# Altium project KNX_MCU_8CH_V1.2.PrjPcb
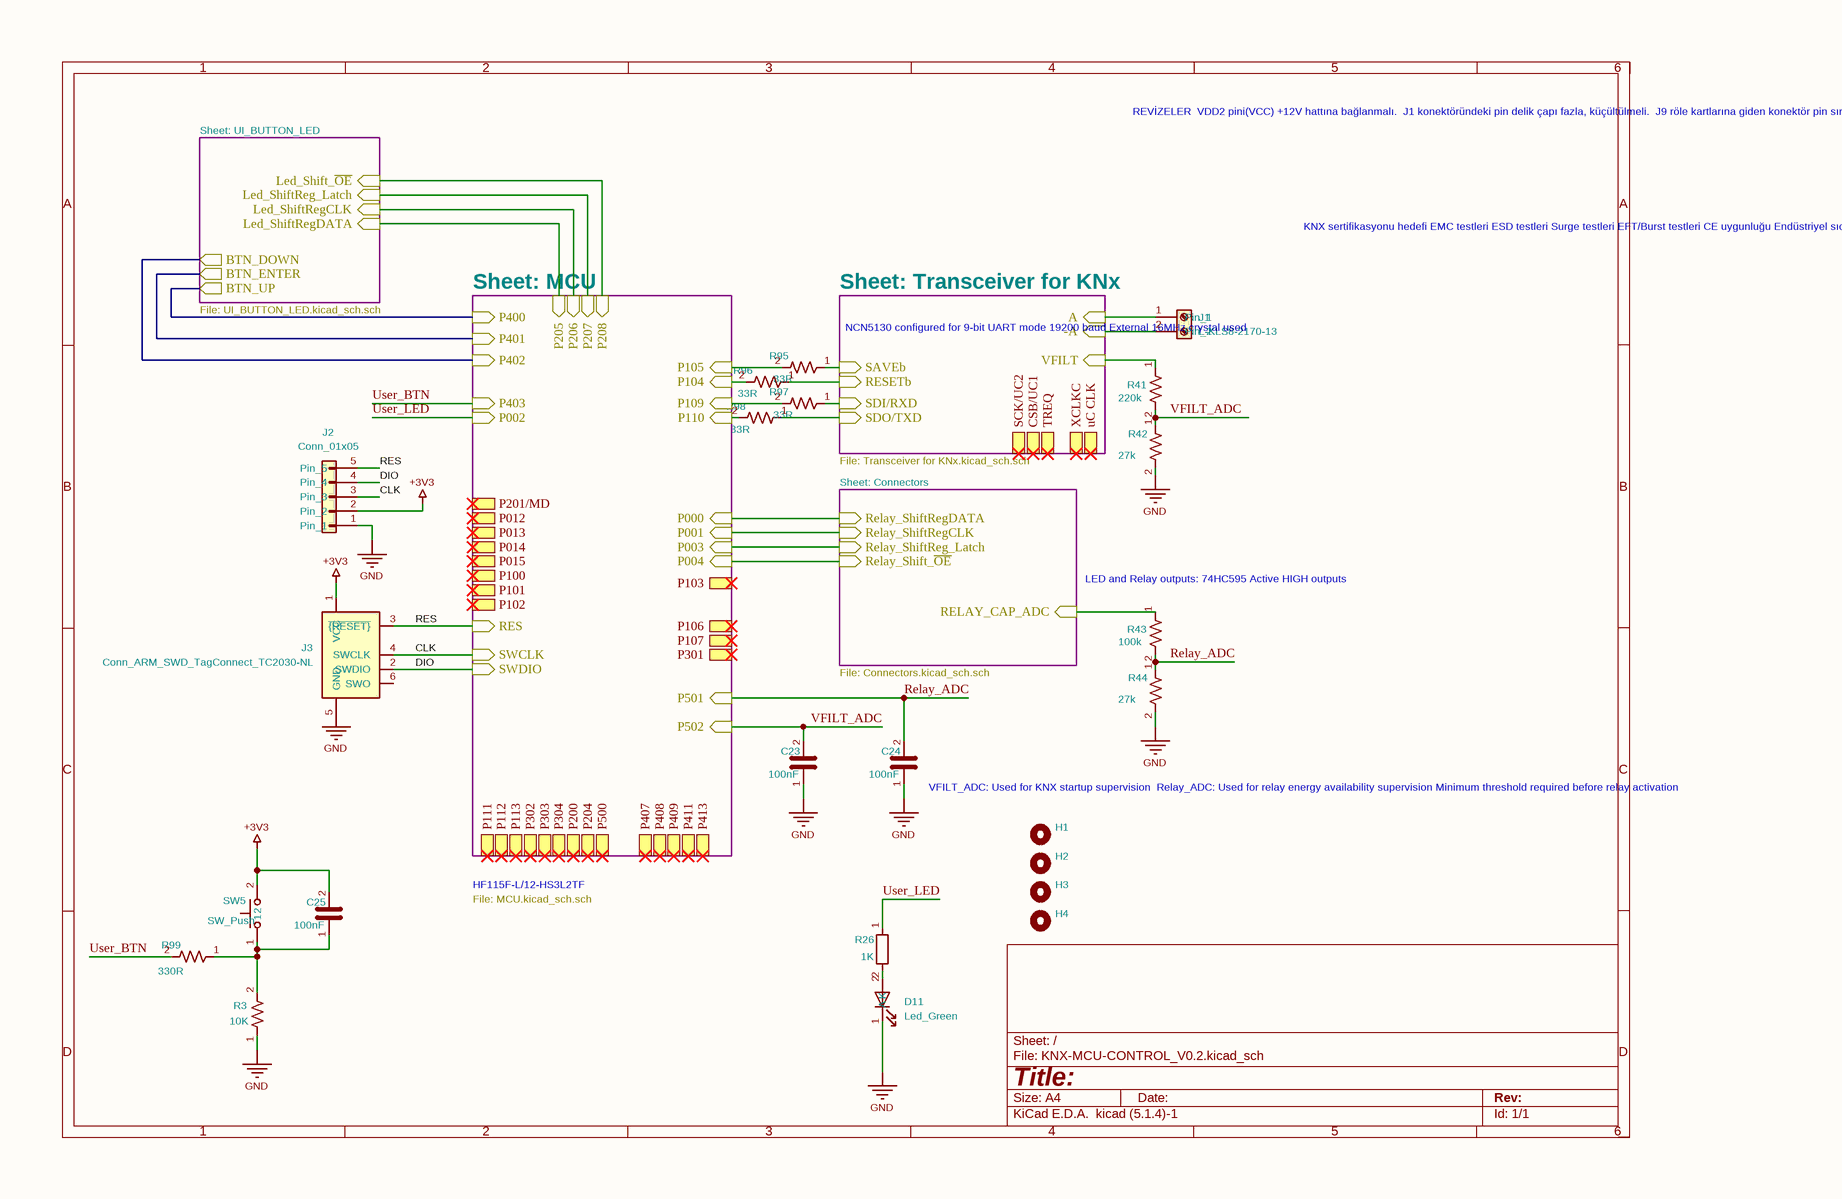
[diagram p0: KNX-MCU-CONTROL_V0.2.SchDoc]
4 sheets, 85 parts. Net scope: hierarchical (ports join the sheet entries above them; power ports are global).
Board file: KNX_MCU_8CH_V1.2.PcbDoc
Sheets:
  KNX-MCU-CONTROL_V0.2.SchDoc
    Transceiver for KNx = Transceiver for KNx.SchDoc
    Connectors = Connectors.SchDoc
    UI_BUTTON_LED = UI_BUTTON_LED.SchDoc

## Sheet KNX-MCU-CONTROL_V0.2.SchDoc
size 297 x 209 mm

### Parts
C23  100nF  [C_0603_1608Metric]
C24  100nF  [C_0603_1608Metric]
C25  100nF  [C_0603_1608Metric]
D11  Led_Green  [LED_D3.0mm]
H1  YP-1132-20-0-N-0  [MountingHole_3mm]  (value not drawn)
H2  YP-1132-20-0-N-0  [MountingHole_3mm]  (value not drawn)
H3  YP-1132-20-0-N-0  [MountingHole_3mm]  (value not drawn)
H4  YP-1132-20-0-N-0  [MountingHole_3mm]  (value not drawn)
J1  L-KLS8-2170-13  [Samtec_HPM-02-01-x-S_Straight_1x02_Pitch5.08mm]
J2  Conn_01x05  [PinHeader_1x05_P2.54mm_Vertical]  (no BOM)
J3  Conn_ARM_SWD_TagConnect_TC2030-NL  [Tag-Connect_TC2030-IDC-NL_2x03_P1.27mm_Vertical]  (no BOM)
R3  10K  [R_0603_1608Metric]
R26  1K  [R_0603_1608Metric]
R41  220k  [R_0603_1608Metric]
R42  27k  [R_0603_1608Metric]
R43  100k  [R_0603_1608Metric]
R44  27k  [R_0603_1608Metric]
R95  33R  [R_0603_1608Metric]
R96  33R  [R_0603_1608Metric]
R97  33R  [R_0603_1608Metric]
R98  33R  [R_0603_1608Metric]
R99  330R  [R_0603_1608Metric]
SW5  SW_Push  [SW_SPST_Omron_B3FS-100xP]

### Sub-sheets
Connectors = Connectors.SchDoc: RELAY_CAP_ADC (in), Relay_ShiftRegCLK (in), Relay_ShiftRegDATA (in), Relay_Shift_~{OE} (in), Relay_ShiftReg_Latch (in)
MCU = MCU.SchDoc (file not in this document): P000 (in), P001 (in), P003 (in), P104 (in), P105 (in), P109 (in), P110 (in), P400 (in), P401 (in), P402 (in), P501 (in), RES (in), SWCLK (in), SWDIO (in), P004 (in), P205 (in), P206 (in), P207 (in), P208 (in), P403 (in), P002 (in), P502 (in), P012, P013, P014, P015, P100, P101, P102, P103, P106, P107, P301, P111, P112, P113, P302, P303, P304, P200, P204, P500, P407, P408, P409, P411, P413, P201/MD
Transceiver for KNx = Transceiver for KNx.SchDoc: RESETb (in), SAVEb (in), SDI/RXD (in), SDO/TXD (in), VFILT (in), A (in), -A (in), SCK/UC2, CSB/UC1, TREQ, XCLKC, uC CLK
UI_BUTTON_LED = UI_BUTTON_LED.SchDoc: BTN_DOWN (out), BTN_ENTER (out), BTN_UP (out), Led_ShiftRegCLK (in), Led_ShiftRegDATA (in), Led_ShiftReg_Latch (in), Led_Shift_~{OE} (in)

### Nets
+3V3: C25.2 J2.2(Pin_2) J3.1(VCC) SW5.2
GND: C23.1 C24.1 D11.1(K) J2.1(Pin_1) J3.5(GND) R3.1 R42.2 R44.2
-A: J1.2(Pin_2) ; sheet Transceiver for KNx/-A
A: J1.1(Pin_1) ; sheet Transceiver for KNx/A
BTN_DOWN: sheet MCU/P402, sheet UI_BUTTON_LED/BTN_DOWN
BTN_ENTER: sheet MCU/P401, sheet UI_BUTTON_LED/BTN_ENTER
BTN_UP: sheet MCU/P400, sheet UI_BUTTON_LED/BTN_UP
CLK: J2.3(Pin_3) J3.4(SWCLK) ; sheet MCU/SWCLK
DIO: J2.4(Pin_4) J3.2(SWDIO) ; sheet MCU/SWDIO
Led_Shift_~{OE}: sheet MCU/P208, sheet UI_BUTTON_LED/Led_Shift_~{OE}
Led_ShiftReg_Latch: sheet MCU/P207, sheet UI_BUTTON_LED/Led_ShiftReg_Latch
Led_ShiftRegCLK: sheet MCU/P206, sheet UI_BUTTON_LED/Led_ShiftRegCLK
Led_ShiftRegDATA: sheet MCU/P205, sheet UI_BUTTON_LED/Led_ShiftRegDATA
Relay_ADC: C24.2 R43.2 R44.1 ; sheet MCU/P501
RELAY_CAP_ADC: R43.1 ; sheet Connectors/RELAY_CAP_ADC
Relay_Shift_~{OE}: sheet Connectors/Relay_Shift_~{OE}, sheet MCU/P004
Relay_ShiftReg_Latch: sheet Connectors/Relay_ShiftReg_Latch, sheet MCU/P003
Relay_ShiftRegCLK: sheet Connectors/Relay_ShiftRegCLK, sheet MCU/P001
Relay_ShiftRegDATA: sheet Connectors/Relay_ShiftRegDATA, sheet MCU/P000
RES: J2.5(Pin_5) J3.3(~{{RESET}}) ; sheet MCU/RES
RESETb: R96.1 ; sheet Transceiver for KNx/RESETb
SAVEb: R95.1 ; sheet Transceiver for KNx/SAVEb
SDI/RXD: R97.1 ; sheet Transceiver for KNx/SDI/RXD
SDO/TXD: R98.1 ; sheet Transceiver for KNx/SDO/TXD
User_BTN: R99.2 ; sheet MCU/P403
User_LED: R26.1 ; sheet MCU/P002
VFILT: R41.1 ; sheet Transceiver for KNx/VFILT
VFILT_ADC: C23.2 R41.2 R42.1 ; sheet MCU/P502
NetC25_1: C25.1 R3.2 R99.1 SW5.1
NetD11_2: D11.2(A) R26.2
NetR95_2: R95.2 ; sheet MCU/P105
NetR96_2: R96.2 ; sheet MCU/P104
NetR97_2: R97.2 ; sheet MCU/P109
NetR98_2: R98.2 ; sheet MCU/P110

Not connected (* = marked no-connect by the designer): J3 6(SWO)

### Notes on the sheet
- Sheet: UI_BUTTON_LED
- REVİZELER
  VDD2 pini(VCC) +12V hattına bağlanmalı.
  J1 konektöründeki pin delik çapı fazla, küçültülmeli.
  J9 röle kartlarına giden konektör pin sırası uyuşmuyor kontrol edilmeli.
  VFILT_ADC P500 den P502 ye bağlanmalı.
  16ch da kapasitör yetmiyor artırmak gerekli
  24ch da kapasitör bankası SMD kılıfı var mı bi bak.
- KNX sertifikasyonu hedefi
  EMC testleri
  ESD testleri
  Surge testleri
  EFT/Burst testleri
  CE uygunluğu
  Endüstriyel sıcaklık aralığı
  Uzun süreli saha kullanımı
  Fan-in akımı 20-40mA sınıfı düşünülüyor
  PCB'de geniş GND poligonları ve düşük EMI hedefleniyor
- File: UI_BUTTON_LED.kicad_sch.sch
- Sheet: MCU
- Sheet: Transceiver for KNx
- (near J1) NCN5130 configured for 9-bit UART mode
  19200 baud
  External 16MHz crystal used
- File: Transceiver for KNx.kicad_sch.sch
- Sheet: Connectors
- (near R43) LED and Relay outputs:
  74HC595
  Active HIGH outputs
- File: Connectors.kicad_sch.sch
- VFILT_ADC:
  Used for KNX startup supervision
  Relay_ADC:
  Used for relay energy availability supervision
  Minimum threshold required before relay activation
- File: MCU.kicad_sch.sch
- HF115F-L/12-HS3L2TF
- 1
- 2
- 3
- 4
- 5
- 6
- A
- B
- C
- D
- Title:
- File: KNX-MCU-CONTROL_V0.2.kicad_sch
- Sheet: /
- KiCad E.D.A.  kicad (5.1.4)-1
- Size: A4
- Date:
- Rev:
- Id: 1/1

### Library data of the parts
C23 C24 = C_1: Manufacturer Part Number: CL10B104KB8NNNC; Manufacturer: Samsung Electro-Mechanics; Package: C_0603; Value: 100nF; Footprint: Capacitor_SMD:C_0603_1608Metric
C25 = C_3: Manufacturer Part Number: CC0603KRX7R9BB104; Manufacturer: YAGEO; Package: C_0603; Value: 100nF; Footprint: Capacitor_SMD:C_0603_1608Metric
D11 = LED: Manufacturer Part Number: TZ-L2-03YYBYG1GDJ30-001; Manufacturer: TUOZHAN; Package: Through Hole,D=3mm; Value: Led_Green; Footprint: LED_THT:LED_D3.0mm
H1-H4 = MountingHole: YP-1132 Geçmeli Yükseltme Parçası (3.2mm delik için) İki Tarafı Kilitli; Manufacturer: Altınkaya; Value: MountingHole; Footprint: MountingHole:MountingHole_3mm; Manufacturer Part Number: YP-1132-20-0-N-0
J1 = Screw_Terminal_01x02: Manufacturer: KLS ELECTRONIC; Manufacturer Part Number: L-KLS8-2170-13; Package: THT V/T; Value: L-KLS8-2170-13; Footprint: Connector_Samtec_HPM_THT:Samtec_HPM-02-01-x-S_Straight_1x02_Pitch5.08mm
R3 = R_US: Manufacturer Part Number: FRC0603J103TS; Manufacturer: FOJAN; Package: R_0603; Value: 10K; Footprint: Resistor_SMD:R_0603_1608Metric
R26 = R_7: Manufacturer Part Number: SCR0603J1K; Manufacturer: VO; Package: R0603; Value: 1K; Footprint: Resistor_SMD:R_0603_1608Metric
R41 = R_US: Manufacturer Part Number: ERJ3EKF2203V; Manufacturer: PANASONIC; Package: R_0603; Value: 220k; Footprint: Resistor_SMD:R_0603_1608Metric
R42 R44 = R_US: Manufacturer Part Number: ERJ3EKF2702V; Manufacturer: PANASONIC; Package: R_0603; Value: 27k; Footprint: Resistor_SMD:R_0603_1608Metric
R43 = R_US: Manufacturer Part Number: RC0603FR-07100KL; Manufacturer: YAGEO; Package: R_0603; Value: 100k; Footprint: Resistor_SMD:R_0603_1608Metric
R95-R98 = R_US: Manufacturer Part Number: 0603SAF330JT5E; Manufacturer: ROYALOHM; Package: R_0603; Value: 33R; Footprint: Resistor_SMD:R_0603_1608Metric
R99 = R_US: Manufacturer Part Number: FRC0603J331 TS; Manufacturer: FOJAN; Package: R_0603; Value: 330R; Footprint: Resistor_SMD:R_0603_1608Metric
SW5 = SW_Push: Manufacturer Part Number: KH-12X12X8H-SMT; Manufacturer: kinghelm; Package: SMD,12x12mm; Value: SW_Push; Footprint: Button_Switch_SMD:SW_SPST_Omron_B3FS-100xP
J2 = Conn_01x05: Value: Conn_01x05; Footprint: Connector_PinHeader_2.54mm:PinHeader_1x05_P2.54mm_Vertical
J3 = Conn_ARM_SWD_TagConnect_TC2030-NL: Value: Conn_ARM_SWD_TagConnect_TC2030-NL; Footprint: Connector:Tag-Connect_TC2030-IDC-NL_2x03_P1.27mm_Vertical

## Sheet Transceiver for KNx.SchDoc
size 297 x 209 mm
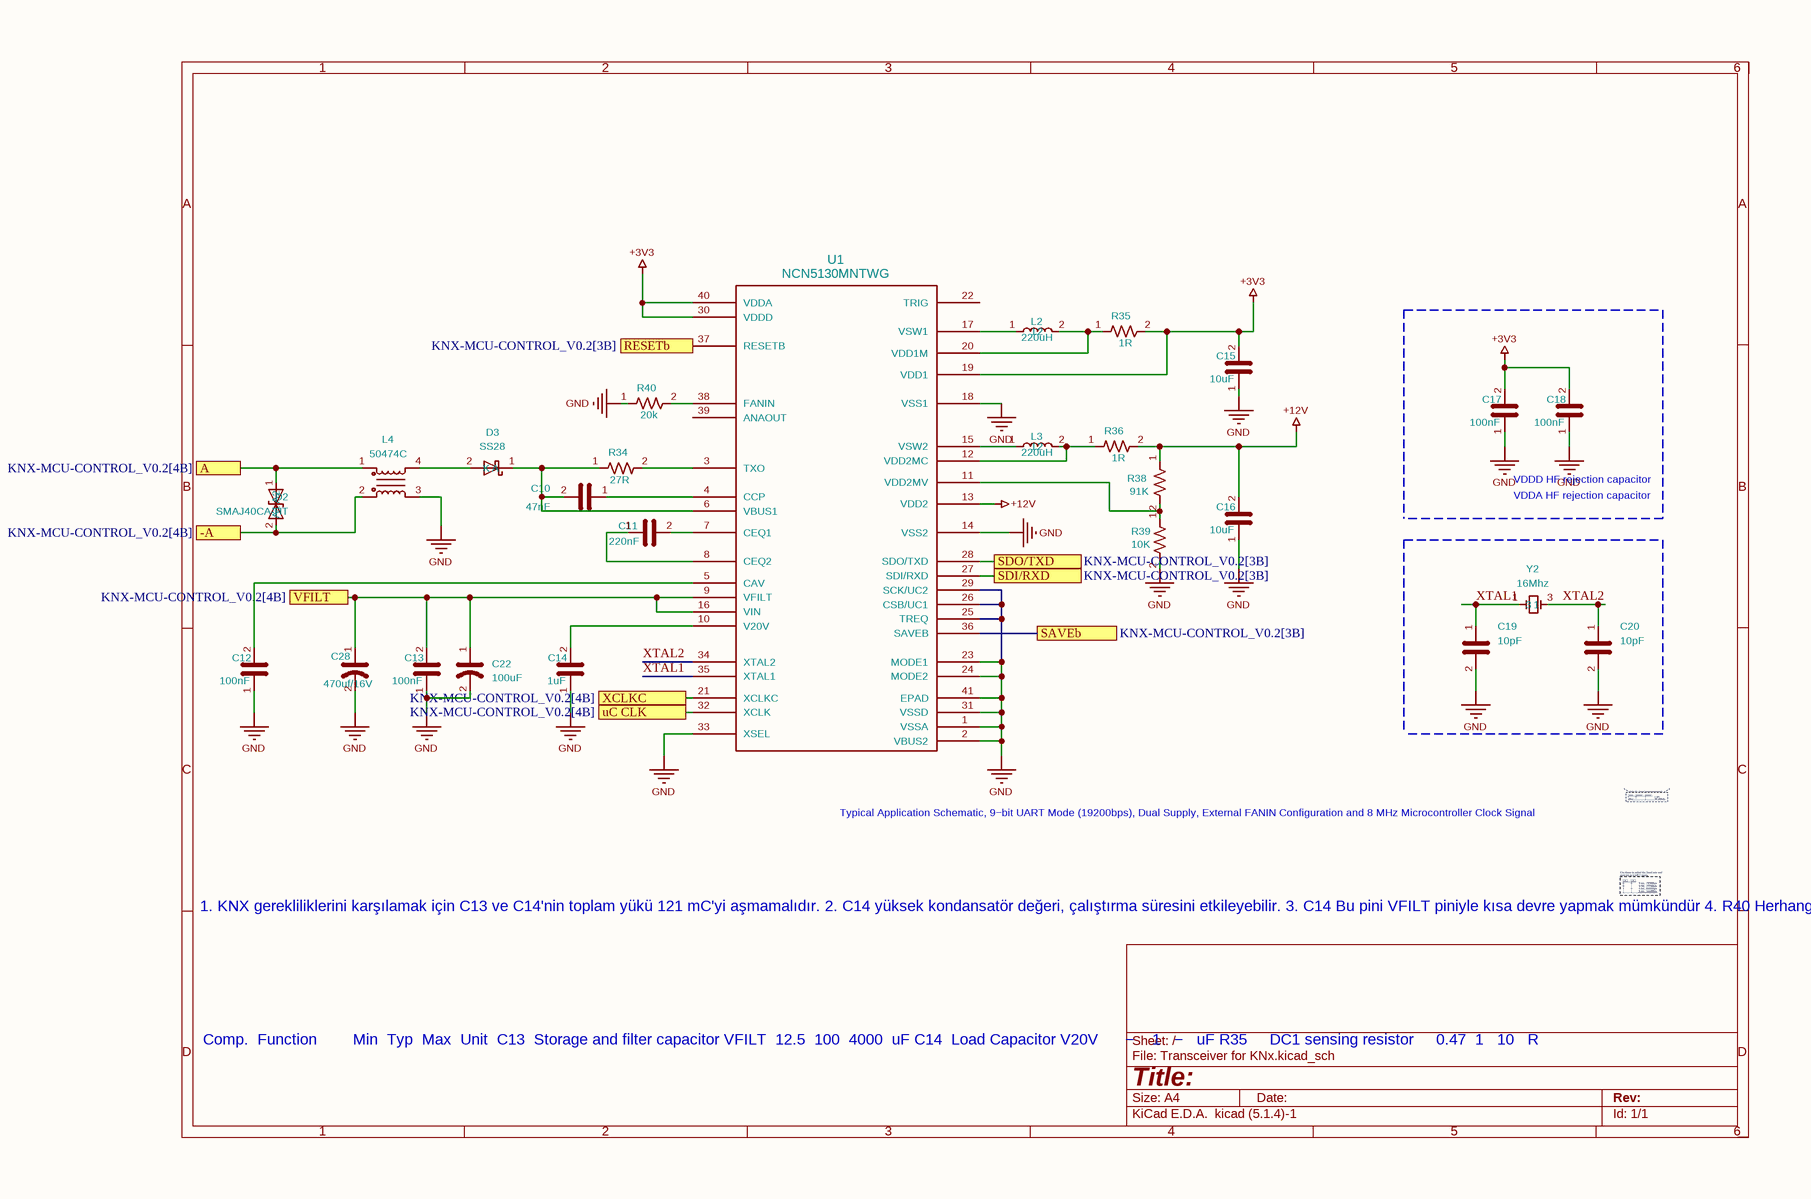
[diagram p1: Transceiver for KNx.SchDoc]

### Parts
C10  47nF  [C_0603_1608Metric]
C11  220nF  [C_0603_1608Metric]
C12  100nF  [C_0603_1608Metric]
C13  100nF  [C_0603_1608Metric]
C14  1uF  [C_0603_1608Metric]
C15  10uF  [C_0805_2012Metric]
C16  10uF  [C_0805_2012Metric]
C17  100nF  [C_0603_1608Metric]
C18  100nF  [C_0603_1608Metric]
C19  10pF  [C_0603_1608Metric]
C20  10pF  [C_0603_1608Metric]
C22  100uF  [CP_Elec_8x10]
C28  470uf/16V  [CP_Elec_8x10]
D2  SMAJ40CA-HT  [D_SMA]
D3  SS28  [D_SMA]
L2  220uH  [L_APV_ANR6028]
L3  220uH  [L_APV_ANR6028]
L4  50474C  [L_CommonMode_50474C_7.5x5.9mm]
R34  27R  [R_2512_6332Metric]
R35  1R  [R_0805_2012Metric]
R36  1R  [R_0805_2012Metric]
R38  91K  [R_0603_1608Metric]
R39  10K  [R_0603_1608Metric]
R40  20k  [R_0603_1608Metric]
U1  NCN5130MNTWG  [QFN40_485AU-01_ONS]
Y2  16Mhz  [Crystal_SMD_SeikoEpson_FA238V-4Pin_3.2x2.5mm]

### Ports
-A (see KNX-MCU-CONTROL_V0.2[4B]), A (see KNX-MCU-CONTROL_V0.2[4B]), RESETb (see KNX-MCU-CONTROL_V0.2[3B]), SAVEb (see KNX-MCU-CONTROL_V0.2[3B]), SDI/RXD (see KNX-MCU-CONTROL_V0.2[3B]), SDO/TXD (see KNX-MCU-CONTROL_V0.2[3B]), uC CLK (see KNX-MCU-CONTROL_V0.2[4B]), VFILT (see KNX-MCU-CONTROL_V0.2[4B]), XCLKC (see KNX-MCU-CONTROL_V0.2[4B])

### Nets
+3V3: C15.2 C17.2 C18.2 R35.2 U1.19(VDD1) U1.30(VDDD) U1.40(VDDA)
+12V: C16.2 R36.2 R38.1 U1.13(VDD2)
GND: C12.1 C13.1 C14.1 C15.1 C16.1 C17.1 C18.1 C19.2 C20.2 C22.2 C28.2 L4.3 R39.2 R40.1 U1.1(VSSA) U1.2(VBUS2) U1.14(VSS2) U1.18(VSS1) U1.23(MODE1) U1.24(MODE2) U1.25(TREQ) U1.26(CSB/UC1) U1.29(SCK/UC2) U1.31(VSSD) U1.33(XSEL) U1.41(EPAD)
-A: D2.2(A2) L4.2 ; port -A
A: D2.1(A1) L4.1 ; port A
RESETb: U1.37(RESETB) ; port RESETb
SAVEb: U1.36(SAVEB) ; port SAVEb
SDI/RXD: U1.27(SDI/RXD) ; port SDI/RXD
SDO/TXD: U1.28(SDO/TXD) ; port SDO/TXD
uC CLK: U1.32(XCLK) ; port uC CLK
VFILT: C13.2 C22.1 C28.1 U1.9(VFILT) U1.16(VIN) ; port VFILT
XCLKC: U1.21(XCLKC) ; port XCLKC
XTAL1: C19.1 U1.35(XTAL1) Y2.1
XTAL2: C20.1 U1.34(XTAL2) Y2.3
NetC10_1: C10.1 U1.4(CCP)
NetC10_2: C10.2 D3.1(K) R34.1 U1.6(VBUS1)
NetC11_1: C11.1 U1.8(CEQ2)
NetC11_2: C11.2 U1.7(CEQ1)
NetC12_2: C12.2 U1.5(CAV)
NetC14_2: C14.2 U1.10(V20V)
NetD3_2: D3.2(A) L4.4
NetL2_1: L2.1 U1.17(VSW1)
NetL2_2: L2.2 R35.1 U1.20(VDD1M)
NetL3_1: L3.1 U1.15(VSW2)
NetL3_2: L3.2 R36.1 U1.12(VDD2MC)
NetR34_2: R34.2 U1.3(TXO)
NetR38_2: R38.2 R39.1 U1.11(VDD2MV)
NetR40_2: R40.2 U1.38(FANIN)

Not connected (* = marked no-connect by the designer): U1 22(TRIG) 39(ANAOUT)

### Notes on the sheet
- VDDA HF rejection capacitor
- VDDD HF rejection capacitor
- Typical Application Schematic, 9−bit UART Mode (19200bps), Dual Supply, External FANIN Configuration
  and 8 MHz Microcontroller Clock Signal
- 1. KNX gerekliliklerini karşılamak için C13 ve C14'nin toplam yükü 121 mC'yi aşmamalıdır.
  2. C14 yüksek kondansatör değeri, çalıştırma süresini etkileyebilir.
  3. C14 Bu pini VFILT piniyle kısa devre yapmak mümkündür
  4. R40 Herhangi bir direnç bağlanmamışsa veya 3,3 V'a çekilmemişse, KNX cihazı 10 mA'lık bir veri
  yolu yükü olarak sertifikalandırılmalıdır. Toprağa kısa devre yapıldığında, KNX cihazı
  20 mA'lık bir veri yolu yükü olarak sertifikalandırılmalıdır. Toprağa 10 k ile 93,1 k arasında
  bir direnç bağlanırsa, cihaz 10 mA (42,2 k), 20 mA (20 k), 30 mA (13,3 k) veya 40 mA (10 k) bus yükü olarak sertifikalandırılmalıdır.
- Comp. 	Function							 Min	 Typ	 Max 	Unit
  C13 	Storage and filter capacitor VFILT 	12.5 	100 	4000 	uF
  C14 	Load Capacitor V20V					 − 		 1 		− 		uF
  R35	    DC1 sensing resistor 				0.47	 1 		10  	R
- 1
- 2
- 3
- 4
- 5
- 6
- A
- B
- C
- D
- Title:
- File: Transceiver for KNx.kicad_sch
- Sheet: /
- KiCad E.D.A.  kicad (5.1.4)-1
- Size: A4
- Date:
- Rev:
- Id: 1/1

### Library data of the parts
C10 = C_3: Manufacturer Part Number: CL10B473KB8NNNC; Manufacturer: SAMSUNG; Package: C_0603; Value: 47nF; Footprint: Capacitor_SMD:C_0603_1608Metric
C11 = C_3: Manufacturer Part Number: CL10B224KB8NNNC; Manufacturer: Samsung Electro-Mechanics; Package: C_0603; Value: 220nF; Footprint: Capacitor_SMD:C_0603_1608Metric
C12 C13 C17 C18 = C_1: as C23 on sheet KNX-MCU-CONTROL_V0.2; Package: C_0603; Value: 100nF; Footprint: Capacitor_SMD:C_0603_1608Metric
C14 = C_3: Manufacturer Part Number: CL10B105KP8NNNC; Manufacturer: Samsung Electro-Mechanics; Package: C_0603; Value: 1uF; Footprint: Capacitor_SMD:C_0603_1608Metric
C15 C16 = C_3: Manufacturer Part Number: CL21B106KOQNNNE; Manufacturer: Samsung Electro-Mechanics; Package: C_0805; Value: 10uF; Footprint: Capacitor_SMD:C_0805_2012Metric
C19 C20 = 20pF_0402_50V_5%: Manufacturer Part Number: CL10C100JB8NNNC; Manufacturer: Samsung Electro-Mechanics; Package: C0603; Value: 10pF; Footprint: Capacitor_SMD:C_0603_1608Metric
C22 = C_US: Manufacturer Part Number: CD035M101F10PKKKV00A; Manufacturer: SUSCON; Package: Radial D8 L10; Value: 100uF; Footprint: Capacitor_SMD:CP_Elec_8x10
C28 = C_US: CAP.EL.470uF 16V 8x10 105C SMD; Manufacturer Part Number: EEEFK1C471P; Manufacturer: PANASONIC(EUROPE); Value: 470uf/16V; Footprint: Capacitor_SMD:CP_Elec_8x10
D2 = D_TVS: Manufacturer: HOTTECH; Manufacturer Part Number: SMAJ40CA-HT; Package: DO214AC (SMA); Value: SMAJ40CA-HT; Footprint: Diode_SMD:D_SMA
D3 = SS28: Manufacturer Part Number: SS18-HT; Manufacturer: HOTTECH; Package: DO214AC (SMA); Value: SS28; Footprint: Diode_SMD:D_SMA
L2 L3 = L: Manufacturer Part Number: NR6028-221M; Manufacturer: CORE MASTER; Package: Non Standard; Value: 220uH; Footprint: Inductor_SMD:L_APV_ANR6028
L4 = Choke_Wurth_WE-CNSW_744232090: Manufacturer: muRata; Manufacturer Part Number: 50474C; Package: SMD-4P,7x5.9mm; Value: 50474C; Footprint: Me_Library:L_CommonMode_50474C_7.5x5.9mm
R34 = R_US: Manufacturer Part Number: HP122WF270JT4E; Manufacturer: ROYALOHM; Package: R_2512; Value: 27R; Footprint: Resistor_SMD:R_2512_6332Metric
R35 R36 = R_US: Manufacturer Part Number: ERJ6RQF1R0V; Manufacturer: PANASONIC; Package: R_0805; Value: 1R; Footprint: Resistor_SMD:R_0805_2012Metric
R38 = R_US: Manufacturer Part Number: 0603SAF9102T5E; Manufacturer: ROYALOHM; Package: R_0603; Value: 91K; Footprint: Resistor_SMD:R_0603_1608Metric
R39 = R_US: Manufacturer Part Number: PS03W4F1002T5E; Manufacturer: ROYALOHM; Package: R_0603; Value: 10K; Footprint: Resistor_SMD:R_0603_1608Metric
R40 = R_US: Manufacturer Part Number: 0603SAF2002T5E; Manufacturer: ROYALOHM; Package: R_0603; Value: 20k; Footprint: Resistor_SMD:R_0603_1608Metric
U1 = NCN5130MNTWG: Manufacturer: onsemi; Manufacturer Part Number: NCN5130MNTWG; Package: QFN-40-EP(6x6); Value: NCN5130MNTWG; Footprint: Me_Library:QFN40_485AU-01_ONS
Y2 = Crystal: Manufacturer Part Number: RH100-16.000-10-1010-EXT; Manufacturer: RALTRON; Package: 4-SMD; Value: 16Mhz; Footprint: Crystal:Crystal_SMD_SeikoEpson_FA238V-4Pin_3.2x2.5mm

## Sheet Connectors.SchDoc
size 209 x 148 mm
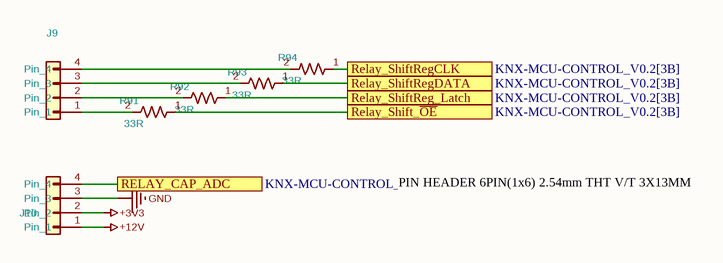
[diagram p2: Connectors.SchDoc]

### Parts
J9  DK501-1X6SBT-3X13MM  [PinHeader_1x04_P2.54mm_Vertical]  (value not drawn)
J10  DK501-1X6SBT-3X13MM  [PinHeader_1x04_P2.54mm_Vertical]  (value not drawn)
R91  33R  [R_0603_1608Metric]
R92  33R  [R_0603_1608Metric]
R93  33R  [R_0603_1608Metric]
R94  33R  [R_0603_1608Metric]

### Ports
RELAY_CAP_ADC (see KNX-MCU-CONTROL_V0.2[4C]), Relay_Shift_~{OE} (see KNX-MCU-CONTROL_V0.2[3B]), Relay_ShiftReg_Latch (see KNX-MCU-CONTROL_V0.2[3B]), Relay_ShiftRegCLK (see KNX-MCU-CONTROL_V0.2[3B]), Relay_ShiftRegDATA (see KNX-MCU-CONTROL_V0.2[3B])

### Nets
+3V3: J10.2(Pin_2)
+12V: J10.1(Pin_1)
GND: J10.3(Pin_3)
RELAY_CAP_ADC: J10.4(Pin_4) ; port RELAY_CAP_ADC
Relay_Shift_~{OE}: R91.1 ; port Relay_Shift_~{OE}
Relay_ShiftReg_Latch: R92.1 ; port Relay_ShiftReg_Latch
Relay_ShiftRegCLK: R94.1 ; port Relay_ShiftRegCLK
Relay_ShiftRegDATA: R93.1 ; port Relay_ShiftRegDATA
NetJ9_1: J9.1(Pin_1) R91.2
NetJ9_2: J9.2(Pin_2) R92.2
NetJ9_3: J9.3(Pin_3) R93.2
NetJ9_4: J9.4(Pin_4) R94.2

### Notes on the sheet
- PIN HEADER 6PIN(1x6) 2.54mm THT V/T 3X13MM
- 1
- 2
- 3
- 4
- A
- B
- Title:
- File: Connectors.kicad_sch
- Sheet: /
- C
- KiCad E.D.A.  kicad (5.1.4)-1
- Size: A5
- Date:
- Rev:
- Id: 1/1

### Library data of the parts
J9 J10 = Conn_01x04: PIN HEADER 6PIN(1x6) 2.54mm THT V/T 3X13MM; Manufacturer: OEM; Value: Conn_01x04; Footprint: Connector_PinHeader_2.54mm:PinHeader_1x04_P2.54mm_Vertical; Manufacturer Part Number: DK501-1X6SBT-3X13MM
R91-R94 = R_US: Manufacturer Part Number: RC0603JR-0733RL; Manufacturer: YAGEO; Package: R_0603; Value: 33R; Footprint: Resistor_SMD:R_0603_1608Metric

## Sheet UI_BUTTON_LED.SchDoc
size 297 x 209 mm
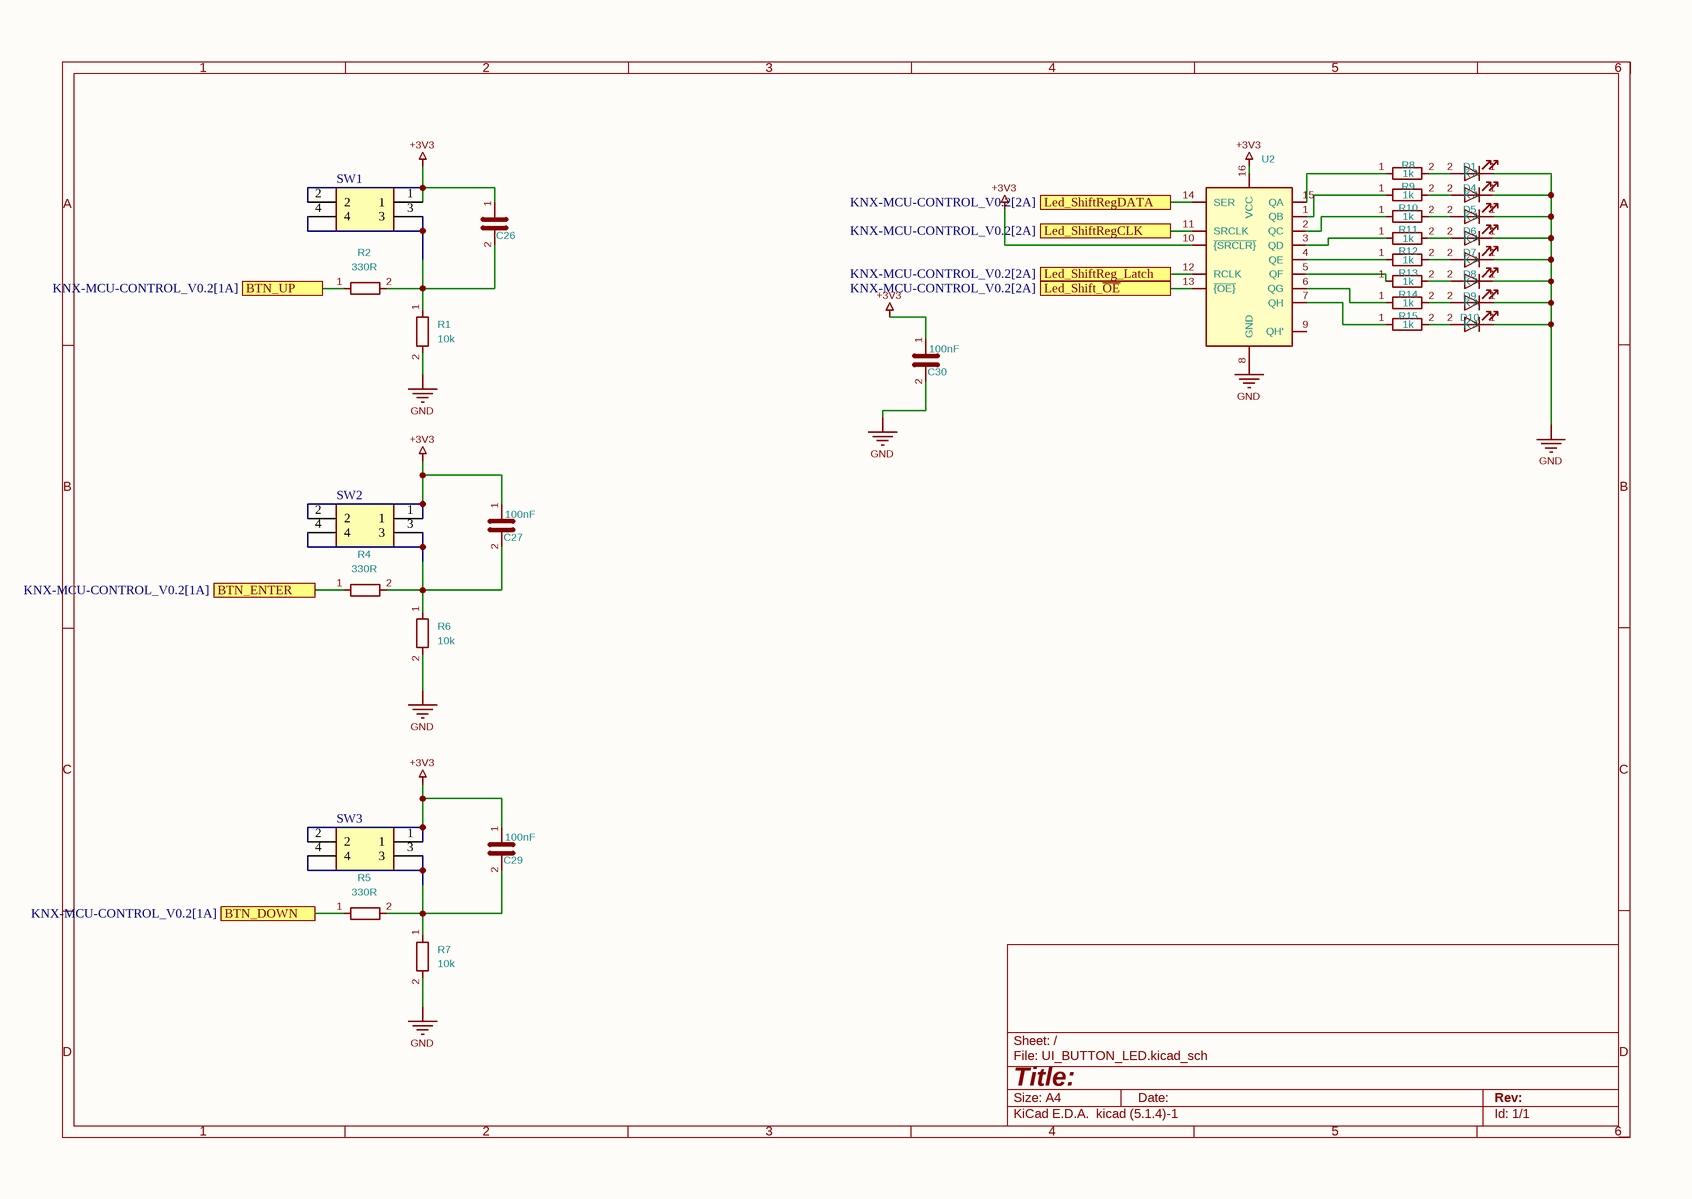
[diagram p3: UI_BUTTON_LED.SchDoc]

### Parts
C26  100nF  [C_0603_1608Metric]  (value not drawn)
C27  100nF  [C_0603_1608Metric]
C29  100nF  [C_0603_1608Metric]
C30  100nF  [C_0603_1608Metric]
D1  LED  [LED_0603_1608Metric]  (value not drawn)
D4  LED  [LED_0603_1608Metric]  (value not drawn)
D5  LED  [LED_0603_1608Metric]  (value not drawn)
D6  LED  [LED_0603_1608Metric]  (value not drawn)
D7  LED  [LED_0603_1608Metric]  (value not drawn)
D8  LED  [LED_0603_1608Metric]  (value not drawn)
D9  LED  [LED_0603_1608Metric]  (value not drawn)
D10  LED  [LED_0603_1608Metric]  (value not drawn)
R1  10k  [R_0603_1608Metric]
R2  330R  [R_0603_1608Metric]
R4  330R  [R_0603_1608Metric]
R5  330R  [R_0603_1608Metric]
R6  10k  [R_0603_1608Metric]
R7  10k  [R_0603_1608Metric]
R8  1k  [R_0603_1608Metric]
R9  1k  [R_0603_1608Metric]
R10  1k  [R_0603_1608Metric]
R11  1k  [R_0603_1608Metric]
R12  1k  [R_0603_1608Metric]
R13  1k  [R_0603_1608Metric]
R14  1k  [R_0603_1608Metric]
R15  1k  [R_0603_1608Metric]
SW1  TSA06141-225B532CA-3C00  [TL1105]  (value not drawn)
SW2  TSA06141-225B532CA-3C00  [TL1105]  (value not drawn)
SW3  TSA06141-225B532CA-3C00  [TL1105]  (value not drawn)
U2  74HC595PW,118  [TSSOP-16_4.4x5mm_P0.65mm]  (value not drawn)

### Ports
BTN_DOWN (see KNX-MCU-CONTROL_V0.2[1A]), BTN_ENTER (see KNX-MCU-CONTROL_V0.2[1A]), BTN_UP (see KNX-MCU-CONTROL_V0.2[1A]), Led_Shift_~{OE} (see KNX-MCU-CONTROL_V0.2[2A]), Led_ShiftReg_Latch (see KNX-MCU-CONTROL_V0.2[2A]), Led_ShiftRegCLK (see KNX-MCU-CONTROL_V0.2[2A]), Led_ShiftRegDATA (see KNX-MCU-CONTROL_V0.2[2A])

### Nets
+3V3: C26.1 C27.1 C29.1 C30.1 SW1.1 SW1.2 SW2.1 SW2.2 SW3.1 SW3.2 U2.10(~{{SRCLR}}) U2.16(VCC)
GND: C30.2 D1.1(K) D4.1(K) D5.1(K) D6.1(K) D7.1(K) D8.1(K) D9.1(K) D10.1(K) R1.2 R6.2 R7.2 U2.8(GND)
BTN_DOWN: R5.1 ; port BTN_DOWN
BTN_ENTER: R4.1 ; port BTN_ENTER
BTN_UP: R2.1 ; port BTN_UP
Led_Shift_~{OE}: U2.13(~{{OE}}) ; port Led_Shift_~{OE}
Led_ShiftReg_Latch: U2.12(RCLK) ; port Led_ShiftReg_Latch
Led_ShiftRegCLK: U2.11(SRCLK) ; port Led_ShiftRegCLK
Led_ShiftRegDATA: U2.14(SER) ; port Led_ShiftRegDATA
NetC26_2: C26.2 R1.1 R2.2 SW1.3 SW1.4
NetC27_2: C27.2 R4.2 R6.1 SW2.3 SW2.4
NetC29_2: C29.2 R5.2 R7.1 SW3.3 SW3.4
NetD1_2: D1.2(A) R8.2
NetD4_2: D4.2(A) R9.2
NetD5_2: D5.2(A) R10.2
NetD6_2: D6.2(A) R11.2
NetD7_2: D7.2(A) R12.2
NetD8_2: D8.2(A) R13.2
NetD9_2: D9.2(A) R14.2
NetD10_2: D10.2(A) R15.2
NetR8_1: R8.1 U2.15(QA)
NetR9_1: R9.1 U2.1(QB)
NetR10_1: R10.1 U2.2(QC)
NetR11_1: R11.1 U2.3(QD)
NetR12_1: R12.1 U2.4(QE)
NetR13_1: R13.1 U2.5(QF)
NetR14_1: R14.1 U2.6(QG)
NetR15_1: R15.1 U2.7(QH)

Not connected (* = marked no-connect by the designer): U2 9(QH')

### Notes on the sheet
- 1
- 2
- 3
- 4
- 5
- 6
- A
- B
- C
- D
- Title:
- File: UI_BUTTON_LED.kicad_sch
- Sheet: /
- KiCad E.D.A.  kicad (5.1.4)-1
- Size: A4
- Date:
- Rev:
- Id: 1/1

### Library data of the parts
C26 C27 C29 = C_3: as C25 on sheet KNX-MCU-CONTROL_V0.2; Package: C_0603; Value: 100nF; Footprint: Capacitor_SMD:C_0603_1608Metric
C30 = C_1: Manufacturer Part Number: CC0603KRX7R9BB104; Manufacturer: YAGEO; Package: C_0603; Value: 100nF; Footprint: Capacitor_SMD:C_0603_1608Metric
D1 D4-D10 = LED: Manufacturer: LITEON; Manufacturer Part Number: LTST-C190KFKT-5A; Package: L_0603; Value: LED; Footprint: LED_SMD:LED_0603_1608Metric
R1 R6 R7 = R: Manufacturer: FOJAN; Manufacturer Part Number: FRC0603J103TS; Package: R_0603; Value: 10k; Footprint: Resistor_SMD:R_0603_1608Metric
R2 R4 R5 = R: Manufacturer: FOJAN; Manufacturer Part Number: FRC0603J331 TS; Package: R_0603; Value: 330R; Footprint: Resistor_SMD:R_0603_1608Metric
R8-R15 = R: Manufacturer: YAGEO; Manufacturer Part Number: RC0603JR-071KL; Package: R_0603; Value: 1k; Footprint: Resistor_SMD:R_0603_1608Metric
SW1-SW3 = TL1105BF160Q: Through Hole-4P,8.2x7.6mm; Manufacturer: Khon; Manufacturer Part Number: TSA06141-225B532CA-3C00
U2 = 74HC595: Manufacturer: Nexperia; Manufacturer Part Number: 74HC595PW,118; Package: TSSOP-16; Value: 74HC595PW,118; Footprint: Package_SO:TSSOP-16_4.4x5mm_P0.65mm

## Nets that join several sheets
+3V3: KNX-MCU-CONTROL_V0.2 (C25.2 J2.2 J3.1 SW5.2), Transceiver for KNx (7 pins), Connectors (J10.2), UI_BUTTON_LED (12 pins)
+12V: Transceiver for KNx (C16.2 R36.2 R38.1 U1.13), Connectors (J10.1)
GND: KNX-MCU-CONTROL_V0.2 (8 pins), Transceiver for KNx (26 pins), Connectors (J10.3), UI_BUTTON_LED (13 pins)
-A: KNX-MCU-CONTROL_V0.2 (J1.2), Transceiver for KNx (D2.2 L4.2)
A: KNX-MCU-CONTROL_V0.2 (J1.1), Transceiver for KNx (D2.1 L4.1)
RELAY_CAP_ADC: KNX-MCU-CONTROL_V0.2 (R43.1), Connectors (J10.4)
RESETb: KNX-MCU-CONTROL_V0.2 (R96.1), Transceiver for KNx (U1.37)
SAVEb: KNX-MCU-CONTROL_V0.2 (R95.1), Transceiver for KNx (U1.36)
SDI/RXD: KNX-MCU-CONTROL_V0.2 (R97.1), Transceiver for KNx (U1.27)
SDO/TXD: KNX-MCU-CONTROL_V0.2 (R98.1), Transceiver for KNx (U1.28)
VFILT: KNX-MCU-CONTROL_V0.2 (R41.1), Transceiver for KNx (5 pins)